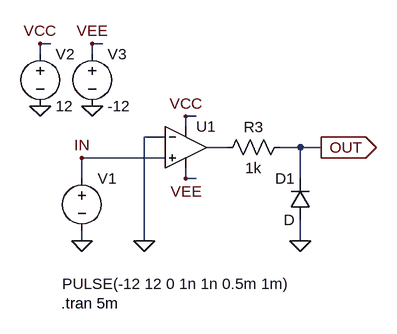
[diagram p0: schematic Sub_Osc_In_Buff_Comparetor.asc]
Sub_Osc_In_Buff_Comparetor.asc, the LTspice schematic file:
Version 4
SHEET 1 880 680
WIRE 272 -80 256 -80
WIRE 352 -80 336 -80
WIRE 256 -64 256 -80
WIRE 336 -64 336 -80
WIRE 496 32 480 32
WIRE 480 48 480 32
WIRE 448 64 416 64
WIRE 544 80 512 80
WIRE 656 80 624 80
WIRE 688 80 656 80
WIRE 448 96 320 96
WIRE 320 128 320 96
WIRE 480 128 480 112
WIRE 496 128 480 128
WIRE 656 128 656 80
WIRE 320 224 320 208
WIRE 416 224 416 64
WIRE 656 224 656 192
FLAG 320 224 0
FLAG 656 224 0
FLAG 480 32 VCC
FLAG 480 128 VEE
FLAG 256 16 0
FLAG 336 16 0
FLAG 256 -80 VCC
FLAG 336 -80 VEE
FLAG 688 80 OUT
IOPIN 688 80 Out
FLAG 416 224 0
FLAG 320 96 IN
SYMBOL voltage 320 112 R0
WINDOW 3 -30 178 Left 2
WINDOW 123 0 0 Left 0
WINDOW 39 0 0 Left 0
SYMATTR Value PULSE(-12 12 0 1n 1n 0.5m 1m)
SYMATTR InstName V1
SYMBOL diode 672 192 R180
WINDOW 0 24 64 Left 2
WINDOW 3 24 0 Left 2
SYMATTR InstName D1
SYMBOL Opamps\\UniversalOpamp2 480 80 R0
SYMATTR InstName U1
SYMBOL voltage 256 -80 R0
WINDOW 123 0 0 Left 0
WINDOW 39 0 0 Left 0
SYMATTR InstName V2
SYMATTR Value 12
SYMBOL voltage 336 -80 R0
WINDOW 123 0 0 Left 0
WINDOW 39 0 0 Left 0
SYMATTR InstName V3
SYMATTR Value -12
SYMBOL res 640 64 R90
WINDOW 0 0 56 VBottom 2
WINDOW 3 32 56 VTop 2
SYMATTR InstName R3
SYMATTR Value 1k
TEXT 288 320 Left 2 !.tran 5m

The netlist it stands for:
* Sub_Osc_In_Buff_Comparetor.asc
V1 IN 0 PULSE(-12 12 0 1n 1n 0.5m 1m)
D1 0 OUT D
XU1 IN 0 VCC VEE N001 level.2 Avol=1Meg GBW=10Meg Slew=10Meg ilimit=25m rail=0 Vos=0 phimargin=45 en=0 enk=0 in=0 ink=0 Rin=500Meg  ; pins IN+ IN- V+ V- OUT
V2 VCC 0 12
V3 VEE 0 -12
R3 OUT N001 1k
.model D D
.lib standard.dio
.tran 5m
.lib UniversalOpamps2.sub
.backanno
.end